# EAGLE board v3c_pcb (EAGLE 6.5.0), part 1 of 3
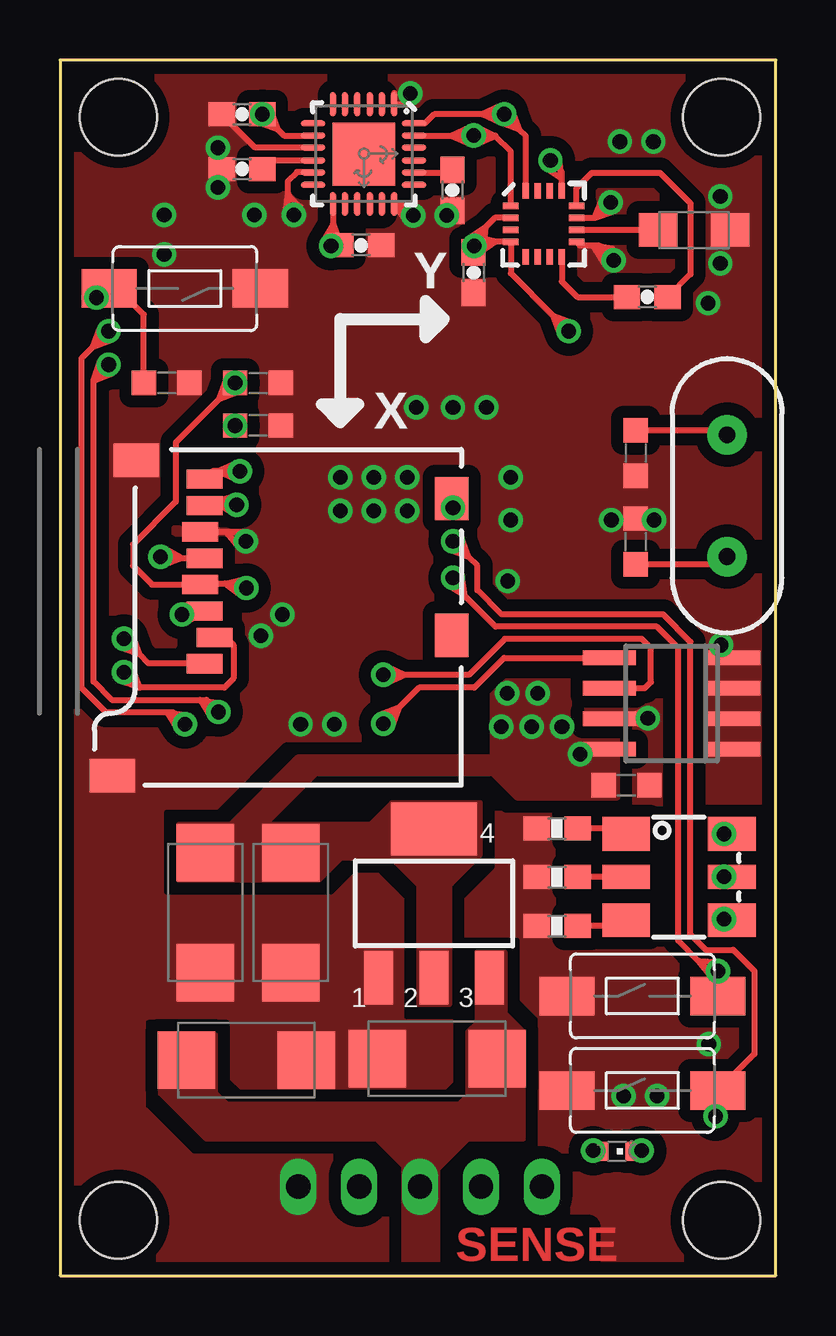
[diagram p2: board, top side]
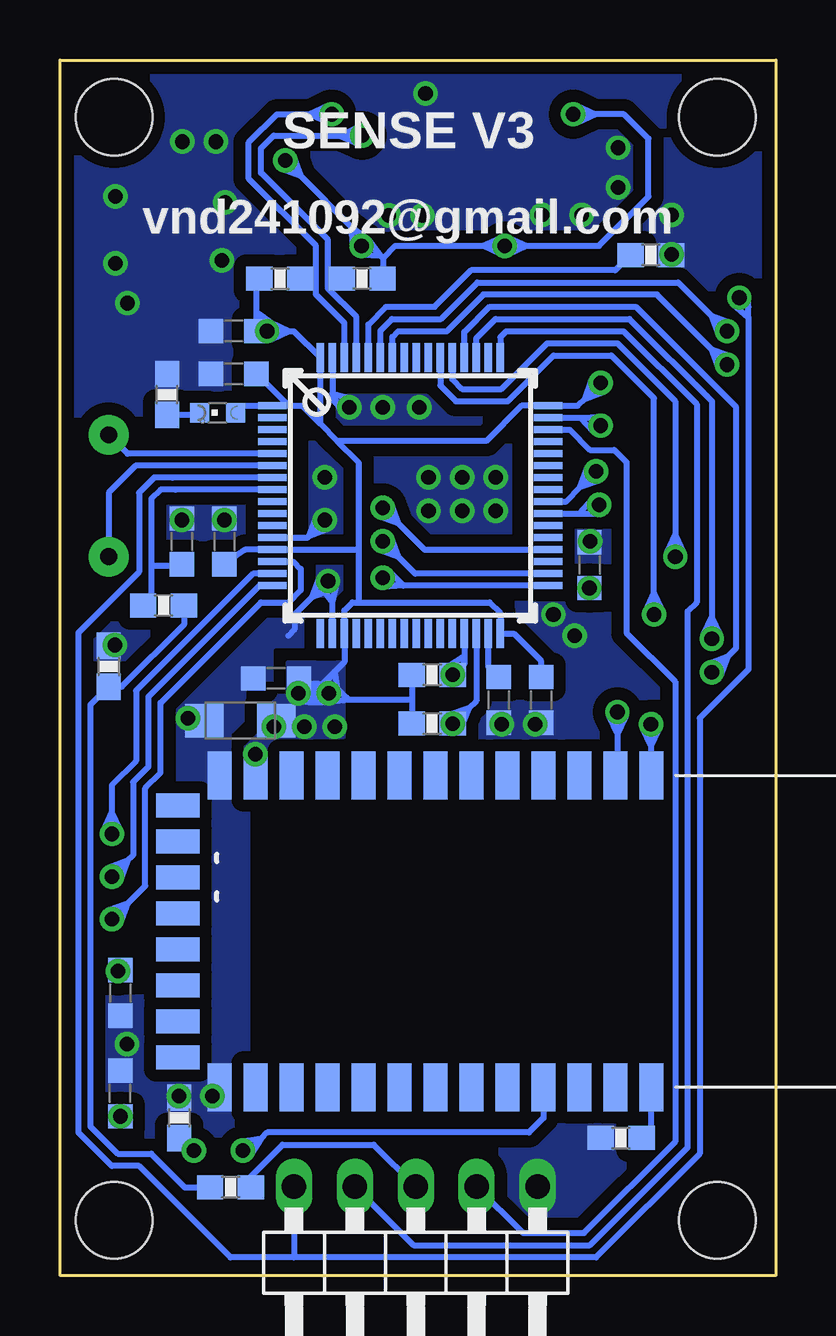
[diagram p3: board, bottom side, seen from below]

Size 29.84 x 50.67 mm. Coordinates in mm from the lower left corner, seen from the top.
Outline: 29.84,50.67 0,50.67 0,0 29.84,0 29.84,50.67
Copper layers (1*16): Top 0.035mm / dielectric 1.5mm / Bottom 0.035mm
Design rules "default *": minimum track width 10mil, minimum drill 24mil, track to track 8mil, track to pad 8mil, pad to pad 0mil, via to via 10mil, smd to smd 8mil, copper to edge 20mil, drill to drill 10mil, minimum pad ring 10mil, minimum via ring 8mil, stop-mask expansion 0mil, vias tented up to drill 100mil, thermal gap 10mil
Net classes: 1 power: width 0.15 mm, drill 0.2 mm, clearance 0.152 mm
Holes 3.2 mm at 2.44,48.29 27.58,48.29 2.44,2.31 27.58,2.31

## Footprints (pad centres in the part's own frame; a part is rotated, then mirrored left to right if it is on the bottom)
C-0603 = smd 1.016 x 1.016: 1 -0.953,0; 2 0.953,0
SMC_C = smd 2.4 x 2.4: + -2.5,0; - 2.5,0
SMC_A = smd 1.6 x 1.4: + -1.5,0; - 1.5,0
SPARKFUN_0603-CAP = smd 1.1 x 1: 1 -0.85,0; 2 0.85,0
SO-08 = smd 0.6 x 2.2: 1 -1.905,-2.6; 2 -0.635,-2.6; 3 0.635,-2.6; 4 1.905,-2.6; 5 1.905,2.6; 6 0.635,2.6; 7 -0.635,2.6; 8 -1.905,2.6
LINEAR_SOT223 = smd 1.219 x 2.235: 1 -2.311,-3.099; 2 0,-3.099; 3 2.311,-3.099 | smd 3.6 x 2.2: 4 0,3.099
TESTING_QFN-24-4MM2 = smd 1.016 x 0.254: 1 -2.066,1.257; 2 -2.066,0.75; 3 -2.066,0.247; 4 -2.066,-0.287; 5 -2.066,-0.792; 6 -2.066,-1.297; 13 2.086,-1.297; 14 2.086,-0.792; 15 2.086,-0.287; 16 2.086,0.247; 17 2.086,0.75; 18 2.086,1.257 | smd 0.254 x 1.016: 7 -1.267,-2.122; 8 -0.762,-2.122; 9 -0.258,-2.122; 10 0.278,-2.122; 11 0.78,-2.122; 12 1.287,-2.122; 19 1.287,2.082; 20 0.78,2.082; 21 0.278,2.082; 22 -0.258,2.082; 23 -0.762,2.082; 24 -1.267,2.082 | smd 2.616 x 2.616: P$1 0.02,-0.01
SPARKFUN_16LPCC = smd 0.65 x 0.28: 1 -1.37,0.75; 2 -1.37,0.25; 3 -1.37,-0.25; 4 -1.37,-0.75; 9 1.37,-0.75; 10 1.37,-0.25; 11 1.37,0.25; 12 1.37,0.75 | smd 0.28 x 0.65: 5 -0.75,-1.37; 6 -0.25,-1.37; 7 0.25,-1.37; 8 0.75,-1.37; 13 0.75,1.37; 14 0.25,1.37; 15 -0.25,1.37; 16 -0.75,1.37
1X05/90 = drill 1.016 long: 1 -5.08,-3.81; 2 -2.54,-3.81; 3 0,-3.81; 4 2.54,-3.81; 5 5.08,-3.81
CHIPLED_0603 = smd 0.8 x 0.8: A 0,-0.75; C 0,0.75
SPARKFUN_0603-RES = smd 1.1 x 1: 1 -0.85,0; 2 0.85,0
TACTILE-SWITCH-1101NE = smd 2.3 x 1.6: P$1 -3.15,0; P$2 3.15,0
MICRO-SD-SOCKET-PP = smd 0.8 x 1.5: 1 -8.94,10.7; 2 -7.84,10.3; 3 -6.74,10.7; 4 -5.64,10.9; 5 -4.54,10.7; 6 -3.44,10.9; 7 -2.34,10.7; 8 -1.24,10.7 | smd 1.8 x 1.4: CD1 -2.05,0.4; CD2 -7.75,0.4 | smd 1.4 x 1.9: GND1 -13.6,14.55; GND3 -0.45,13.55
BLUETOOTH_SMD = smd 2 x 1: 1 0,0; 2 0,-1.5; 3 0,-3; 4 0,-4.5; 5 0,-6; 6 0,-7.5; 7 0,-9; 8 0,-10.5; 9 0,-12; 10 0,-13.5; 11 0,-15; 12 0,-16.5; 13 0,-18; 22 13,-18; 23 13,-16.5; 24 13,-15; 25 13,-13.5; 26 13,-12; 27 13,-10.5; 28 13,-9; 29 13,-7.5; 30 13,-6; 31 13,-4.5; 32 13,-3; 33 13,-1.5; 34 13,0 | smd 1 x 1.8: 14 1.25,-19.75; 15 2.75,-19.75; 16 4.25,-19.75; 17 5.75,-19.75; 18 7.25,-19.75; 19 8.75,-19.75; 20 10.25,-19.75; 21 11.75,-19.75
LQFP64 = smd 0.3 x 1.2: 1 -3.75,-5.75; 2 -3.25,-5.75; 3 -2.75,-5.75; 4 -2.25,-5.75; 5 -1.75,-5.75; 6 -1.25,-5.75; 7 -0.75,-5.75; 8 -0.25,-5.75; 9 0.25,-5.75; 10 0.75,-5.75; 11 1.25,-5.75; 12 1.75,-5.75; 13 2.25,-5.75; 14 2.75,-5.75; 15 3.25,-5.75; 16 3.75,-5.75; 33 3.75,5.75; 34 3.25,5.75; 35 2.75,5.75; 36 2.25,5.75; 37 1.75,5.75; 38 1.25,5.75; 39 0.75,5.75; 40 0.25,5.75; 41 -0.25,5.75; 42 -0.75,5.75; 43 -1.25,5.75; 44 -1.75,5.75; 45 -2.25,5.75; 46 -2.75,5.75; 47 -3.25,5.75; 48 -3.75,5.75 | smd 1.2 x 0.3: 17 5.75,-3.75; 18 5.75,-3.25; 19 5.75,-2.75; 20 5.75,-2.25; 21 5.75,-1.75; 22 5.75,-1.25; 23 5.75,-0.75; 24 5.75,-0.25; 25 5.75,0.25; 26 5.75,0.75; 27 5.75,1.25; 28 5.75,1.75; 29 5.75,2.25; 30 5.75,2.75; 31 5.75,3.25; 32 5.75,3.75; 49 -5.75,3.75; 50 -5.75,3.25; 51 -5.75,2.75; 52 -5.75,2.25; 53 -5.75,1.75; 54 -5.75,1.25; 55 -5.75,0.75; 56 -5.75,0.25; 57 -5.75,-0.25; 58 -5.75,-0.75; 59 -5.75,-1.25; 60 -5.75,-1.75; 61 -5.75,-2.25; 62 -5.75,-2.75; 63 -5.75,-3.25; 64 -5.75,-3.75
SMD = smd 1.99 x 1.4: B+ -2.2,-1.8; B- 2.2,-1.8; R+ -2.2,1.8; R- 2.2,1.8 | smd 1.99 x 1: G+ -2.2,0; G- 2.2,0
HC49US = drill 0.7 pad 1.651: 1 -2.54,0; 2 2.54,0

## Placement (x,y rotation side)
C1  [C-0603]  24,30.61 90 top
C2  [C-0603]  7.77,29.62 270 bottom
C3  6v 10u  [SMC_C]  9.63,15.14 270 top
C4  6v 10u  [SMC_A]  22.33,23.14 180 bottom
C5  16v47u  [SMC_C]  15.72,9.04 180 top
C6  [C-0603]  22.61,37.59 0 bottom
C7  [C-0603]  27.33,7.59 90 bottom
C8  [C-0603]  8.26,37.21 180 top
C9  [C-0603]  22.99,30.61 270 bottom
C10  [C-0603]  22.61,39.37 0 bottom
C11  [C-0603]  23.62,20.45 180 top
C12  [C-0603]  9.78,24 90 bottom
C13  [C-0603]  4.45,37.21 0 top
C14  [C-0603]  20.83,24.89 0 bottom
C15  [C-0603]  24,34.29 270 top
C16  16v47u  [SMC_C]  7.77,8.99 0 top
C17  [C-0603]  8.26,35.43 0 top
C18  [C-0603]  11.56,24 270 bottom
C19  [C-0603]  24.77,30.61 270 bottom
C23  6v 10u  [SMC_C]  6.07,15.14 270 top
C25  [C-0603]  27.33,11.79 270 bottom
C26  100n  [SPARKFUN_0603-CAP]  7.59,46.13 180 top
C27  100n  [SPARKFUN_0603-CAP]  24.49,40.79 0 top
C28  4.7u  [SMC_A]  26.44,43.59 0 top
C29  100n  [SPARKFUN_0603-CAP]  17.25,41.81 270 top
C36  2.2n  [SPARKFUN_0603-CAP]  16.36,45.24 270 top
C38  100n  [SPARKFUN_0603-CAP]  12.55,42.95 0 top
C39  100n  [SPARKFUN_0603-CAP]  7.59,48.41 180 top
IC2  24LC256SN  [SO-08]  25.5,23.85 90 top
IC3  LINEAR_MC33269ST-3.3T3  [LINEAR_SOT223]  15.6,15.52 0 top
IC4  MPU-6050  [TESTING_QFN-24-4MM2]  12.67,46.76 270 top
IC5  HMC5883L  [SPARKFUN_16LPCC]  20.17,43.84 0 top
JP4  [1X05/90]  15.01,-0.1 180 bottom
LD1  [CHIPLED_0603]  23.22,5.18 270 top
LD2  [CHIPLED_0603]  23.27,35.97 90 bottom
R1  10K  [SPARKFUN_0603-RES]  25.37,36.73 90 bottom
R2  10K  [SPARKFUN_0603-RES]  20.73,14.58 180 top
R3  10K  [SPARKFUN_0603-RES]  20.73,16.61 180 top
R5  10K  [SPARKFUN_0603-RES]  6.45,5.74 180 bottom
R6  10K  [SPARKFUN_0603-RES]  20.73,18.64 180 top
R7  10k  [SPARKFUN_0603-RES]  5.21,42.55 0 bottom
R9  10K  [SPARKFUN_0603-RES]  24.87,6.58 90 bottom
R10  [SPARKFUN_0603-RES]  17.25,41.55 0 bottom
R11  [SPARKFUN_0603-RES]  20.68,41.55 180 bottom
R15  4K7  [SPARKFUN_0603-RES]  14.33,25.04 0 bottom
R16  4K7  [SPARKFUN_0603-RES]  14.33,23.01 180 bottom
R23  10K  [SPARKFUN_0603-RES]  25.53,27.94 180 bottom
R24  10K  [SPARKFUN_0603-RES]  22.73,3.68 0 bottom
R25  10K  [SPARKFUN_0603-RES]  27.81,25.4 270 bottom
S1  RESET  [TACTILE-SWITCH-1101NE]  5.21,41.15 180 top
S2  RESET  [TACTILE-SWITCH-1101NE]  24.28,11.66 0 top
S4  RESET  [TACTILE-SWITCH-1101NE]  24.28,7.72 0 top
SDCARD2  microSD Socket  [MICRO-SD-SOCKET-PP]  16.74,34.44 90 top
U1  HC_05  [BLUETOOTH_SMD]  5.18,20.85 270 bottom
U2  STM32F405RGT  [LQFP64]  15.24,32.51 270 bottom
U$12  RGB_LED  [SMD]  25.81,16.61 0 top
Y2  [HC49US]  27.81,32.51 90 top

## Tracks (layer width: path | path; a pad name or v marks a point on that pad's centre or on a via)
3.3V  (via drill 0.61)
  Top 0.254: 5.82,28.82 5.82,28.85 5.84,28.85 | IC5.2 18.13,44.09 17.75,43.71 | 5.84,28.85 SDCARD2.4 3.84,28.8 3.05,29.59 3.05,30.48 4.83,32.26 4.83,34.73 6.66,36.56 | 9.75,18.53 C3.+ | 20.56,40.02 18.8,41.78 IC5.4 18.17,43.09 | 20.56,40.02 | 20.56,40.02 v21.21,39.37 | 5.84,28.85 6.88,28.85 | 6.88,28.85 7.58,28.85 C2.2 | 20.56,40.02 | 20.56,40.02 21.34,39.73 | v21.21,39.37 21.34,39.73 | 20.56,40.02 | 20.56,40.02 20.85,39.24 | v21.21,39.37 20.85,39.24 | 20.56,40.02 21.34,39.73 | 20.56,40.02 21.34,39.73 | 21.34,39.73 | 6.88,28.85 7.69,29.04 | 7.69,29.04 | 6.88,28.85 7.54,28.36 | C2.2 7.54,28.36 | v17.27,42.93 17.27,43.23 17.75,43.71 | v17.27,42.93 17.27,42.68 C29.1 | 18.17,43.09 17.44,43.09 v17.27,42.93 | C38.1 11.33,42.95 v11.3,42.93 | IC4.13 11.38,43.84 | 11.38,43.84 11.38,43 v11.3,42.93 | IC5.13 20.92,45.7 | 20.92,45.7 20.92,46.01 v20.45,46.48 | C8.2 6.66,36.56 | C39.1 9.09,47.77 | 9.09,47.77 | 9.09,47.77 9.33,47.52 IC4.8 | 20.56,40.02 | 20.56,40.02 21.34,39.73 | 20.56,40.02 20.85,39.24 | 20.85,39.24 | v21.21,39.37 20.85,39.24 | 21.05,39.72 | v21.21,39.37 21.05,39.72 | v21.21,39.37 21.05,39.72 | 21.34,39.73 | v21.21,39.37 21.34,39.73 | 20.56,40.02 20.85,39.24 | v21.21,39.37 20.85,39.24 | 7.69,29.04 | C2.2 7.69,29.04 | 6.88,28.85 7.54,28.36 | C2.2 7.54,28.36 | 17.75,43.71 17.65,42.88 | 17.65,42.88 | 17.75,43.71 17.06,43.24 | v17.27,42.93 17.06,43.24 | 18.17,43.09 17.49,42.61 | v17.27,42.93 17.49,42.61 | 18.17,43.09 17.37,43.3 | v17.27,42.93 17.37,43.3 | 11.38,43.84 11.66,43.06 | 11.66,43.06 | 11.38,43.84 10.97,43.11 | v11.3,42.93 10.97,43.11 | 20.92,45.7 20.23,46.17 | v20.45,46.48 20.23,46.17 | 20.92,45.7 20.83,46.52 | 20.83,46.52 | 6.66,36.56 6.95,37.34 | C8.2 6.95,37.34 | 7.43,36.85 | 7.43,36.85
  Top 0.254: 9.09,47.77 8.31,48.05 | C39.1 8.31,48.05 | 9.09,47.77 8.8,48.55 | 8.8,48.55 | 20.56,40.02 20.85,39.24 | 20.85,39.24 | v21.21,39.37 20.85,39.24 | 20.56,40.02 21.34,39.73 | v21.21,39.37 21.05,39.72 | 20.56,40.02 20.85,39.24 | v21.21,39.37 20.85,39.24 | 20.56,40.02 21.34,39.73 | v21.21,39.37 21.34,39.73 | 6.88,28.85 7.54,28.36 | C2.2 7.54,28.36 | 6.88,28.85 7.69,29.04 | C2.2 7.69,29.04 | 17.75,43.71 17.06,43.24 | v17.27,42.93 17.06,43.24 | 17.75,43.71 17.65,42.88 | v17.27,42.93 17.65,42.88 | 18.17,43.09 17.37,43.3 | v17.27,42.93 17.37,43.3 | 18.17,43.09 17.49,42.61 | v17.27,42.93 17.49,42.61 | 11.38,43.84 10.97,43.11 | v11.3,42.93 10.97,43.11 | 11.38,43.84 11.66,43.06 | v11.3,42.93 11.66,43.06 | 20.92,45.7 20.83,46.52 | v20.45,46.48 20.83,46.52 | 20.92,45.7 20.23,46.17 | v20.45,46.48 20.23,46.17 | 6.66,36.56 | 6.66,36.56 7.43,36.85 | C8.2 7.43,36.85 | 6.66,36.56 | 6.66,36.56 6.95,37.34 | C8.2 6.95,37.34 | 6.66,36.56 7.43,36.85 | 6.66,36.56 6.95,37.34 | 6.66,36.56 7.43,36.85 | C8.2 7.43,36.85 | 6.66,36.56 6.95,37.34 | C8.2 6.95,37.34 | 9.09,47.77 8.8,48.55 | C39.1 8.8,48.55 | 9.09,47.77 | 9.09,47.77 8.31,48.05 | C39.1 8.31,48.05 | 9.09,47.77 | 9.09,47.77 8.31,48.05 | 9.09,47.77 8.8,48.55 | C39.1 8.8,48.55 | 9.09,47.77 8.31,48.05 | C39.1 8.31,48.05
  Bottom 0.254: R10.2 16.36,41.34 | 18.4,25.16 17.99,25.57 U2.19 17.99,27.73 17.65,28.07 17.4,28.07 | 18.4,25.16 18.92,24.64 19.07,24.64 | 19.07,24.64 19.49,24.64 | 19.49,24.64 20.19,24.64 | R15.1 15.18,24 | 15.18,24 R16.2 | 15.18,24 17.77,24 | 17.77,24 18.03,24 | 8,28.56 8,28.43 C2.2 7.48,28.42 | 20.32,36.26 U2.1 22.22,36.26 LD2.A | 18.29,34.8 17.4,33.91 17.4,30.35 | 18.29,34.8 18.99,35.5 | 18.99,35.5 U2.64 20.1,39.37 20.3,39.37 | 18.99,35.5 19.75,36.26 20.32,36.26 | 17.4,28.07 11.94,28.07 11.49,27.62 U2.32 10.92,26.76 9.78,25.62 C12.2 | v21.21,39.37 20.3,39.37 | v21.21,39.37 C10.2 21.65,40.17 | 21.65,40.17 21.65,41.17 R11.2 | C6.2 20.32,36.26 | 17.4,30.35 17.4,28.07 | 17.4,30.35 17.49,30.26 U2.13 22.12,30.26 C9.2 | 18.29,34.8 12.06,34.8 10.6,36.26 U2.48 8.25,36.26 7.95,36.56 | U1.12 21.69,20.86 v21.69,21.74 | 21.05,39.72 | 21.05,39.72 | 20.3,39.37 | 20.3,39.37 21.05,39.02 | v21.21,39.37 21.05,39.02 | 21.05,39.72 | 21.05,39.72 | 20.3,39.37 21.05,39.02 | v21.21,39.37 21.05,39.02 | 21.05,39.72 | 21.05,39.72 | 20.3,39.37 21.05,39.02 | v21.21,39.37 21.05,39.02 | 21.65,40.17 21.59,39.34 | v21.21,39.37 21.59,39.34 | 21.65,40.17 20.98,39.68 | v21.21,39.37 20.98,39.68 | 19.07,24.64 19.48,24.65 | 19.48,24.65 19.9,24.66 | 19.9,24.66 | 19.07,24.64 19.54,24.12 | 19.54,24.12 19.63,24.02 | v19.91,24.28 19.63,24.02 | 19.82,23.91 | v19.91,24.28 19.82,23.91 | 19.08,24.65 19.91,24.66 | 19.91,24.66 | 19.08,24.65 19.54,24.12 | 19.54,24.12 19.63,24.03 | 19.63,24.03 | v19.91,24.28 19.63,24.03 | 19.48,24.65 19.01,24.12 | 19.01,24.12 | 19.01,24.12 18.93,24.03 | v18.64,24.28 18.93,24.03 | 19.48,24.65 18.65,24.66 | 18.65,24.66 | 18.74,23.91 | v18.64,24.28 18.74,23.91 | 19.54,24.12 19.02,24.48 | 19.02,24.48 18.86,24.6
  Bottom 0.254: 18.86,24.6 | 18.4,25.16 18.93,24.53 | 18.93,24.53 | 18.4,25.16 18.27,24.34 | v18.64,24.28 18.27,24.34 | 19.49,24.64 19.01,24.12 | 19.01,24.12 18.93,24.02 | v18.64,24.28 18.93,24.02 | 19.49,24.64 19.08,24.65 | 19.08,24.65 18.66,24.66 | 18.66,24.66 | 18.39,24.56 | v18.64,24.28 18.39,24.56 | 17.77,24 18.6,23.9 | v18.64,24.28 18.6,23.9 | R10.2 16.4,42.05 | v11.3,42.93 10.39,42.93 | 10.39,42.93 7.37,42.93 5.31,44.98 5.31,47.4 6.33,48.41 7.53,48.41 | v20.45,46.48 19.8,45.84 | 19.8,45.84 | 19.8,45.84 17.7,43.73 | 17.7,43.73 16.89,42.93 | 16.38,42.42 16.38,41.27 16.4,41.29 R10.2 | 16.38,42.42 16.46,42.5 | 16.46,42.5 16.89,42.93 | 16.89,42.93 v17.27,42.93 | 16.38,42.42 15.88,42.93 12.22,42.93 | 12.22,42.93 v11.3,42.93 | 19.08,24.65 19.48,24.66 | 19.08,24.65 19.54,24.12 | 19.05,23.99 18.74,23.91 | 19.54,24.13 19.63,24.03 | 19.05,23.99 18.74,23.91 | 18.74,23.91 | 19.54,24.12 | 19.05,23.99 18.74,23.91 | 18.74,23.91 | 18.74,23.91 | 18.74,23.91 | 19.54,24.12 | 18.88,23.98 | v18.64,24.28 18.88,23.98 | 19.54,24.13 | 19.05,23.99 18.74,23.91 | 18.74,23.91 | 18.74,23.91 | 19.54,24.13 | 19.54,24.13 19.02,24.48 | 19.54,24.46 19.02,24.08 | 19.02,24.08 18.86,23.97 | 18.86,23.97 | 19.54,24.12 19.02,24.48 | 19.54,24.12 19.02,24.48 | 19.02,24.48 | 17.7,43.73 | 17.7,43.73 17.65,42.9 | v17.27,42.93 17.65,42.9 | 17.7,43.73 | 17.7,43.73 17.04,43.23 | v17.27,42.93 17.04,43.23 | 16.46,42.5 | 16.46,42.5 16.97,43.16 | v17.27,42.93 16.97,43.16 | 16.46,42.5 | 17.7,43.73 17.65,42.9 | 17.7,43.73 17.04,43.23 | v17.27,42.93 17.04,43.23 | 16.46,42.5 16.97,43.16 | v17.27,42.93 16.97,43.16 | 16.46,42.5 17.29,42.55 | 12.22,42.93 11.46,42.58 | 19.8,45.84 | 20.09,46.62 | 19.8,45.84 | 19.8,45.84 20.58,46.12 | 20.58,46.12 | 19.55,24.13 19.62,24.03
  Bottom 0.254: 19.82,23.91 | 19.02,24.48 | 19.02,24.48 19.51,24.59 | 19.02,24.48 19.54,24.09 | 19.05,24.59 19.49,24.63 | 19.05,24.59 19.54,24.11 | 19.55,24.13 19.62,24.03 | 19.65,24.56 | v19.91,24.28 19.65,24.56 | 19.54,24.08 19.7,23.97 | 19.7,23.97 | 19.54,24.12 19.64,24.02 | 19.64,24.02 | 19.65,24.01 | 19.82,24.65 | 19.55,24.13 19.62,24.03 | 19.54,24.09 19.68,23.98 | 19.82,23.91 | 19.82,23.91 | 18.68,23.9 | 19.02,24.08 18.86,23.97 | 18.86,23.97 | 19.02,24.11 18.91,24 | 18.91,24 | 19.51,24.58 19.07,24.62 | 19.07,24.62 18.68,24.66 | 18.68,24.66 | 19.54,24.48 19.02,24.09 | 19.02,24.09 18.88,23.98 | 19.05,24.59 18.72,24.66 | v18.64,24.28 18.68,23.9 | 19.51,23.99 19.02,24.46 | 18.9,24.56 | 19.48,24.66 19.01,24.13 | 19.01,24.13 | 19.01,24.13 18.93,24.03 | 19.55,24.13 | 19.05,23.99 18.74,23.91 | 18.74,23.91 | 19.55,24.13 | 19.55,24.13 19.02,24.48 | 19.02,24.48 18.86,24.6 | 18.86,24.6 | 18.86,23.97 | 18.73,24.65 | 18.86,23.97 | 19.02,24.09 18.88,23.98 | 19.48,24.65 19.01,24.12 | 19.05,23.99 18.74,23.91 | 19.05,24.59 18.72,24.66 | 18.72,24.66 | 19.54,24.13 19.05,23.99 | 19.05,23.99 18.74,23.91 | 18.93,24.03 | 19.48,24.65 19.01,24.12 | 19.01,24.12 | 19.05,23.99 18.74,23.91 | 19.8,45.84 | 7.95,36.56 | 7.95,36.56 C8.2 | 7.53,48.41 C39.1 | 20.3,39.37 21.05,39.72 | 21.05,39.72 | v21.21,39.37 21.05,39.72 | 20.3,39.37 21.05,39.02 | 21.05,39.02 | v21.21,39.37 21.05,39.02 | 21.65,40.17 21.59,39.34 | 21.59,39.34 | 21.65,40.17 20.98,39.68 | v21.21,39.37 20.98,39.68 | 19.7,24.6 | 19.01,24.12 19.54,24.48 | 19.01,24.12 19.51,23.99 | 19.82,23.91 | v19.91,24.28 19.82,23.91 | 19.91,24.66 | v19.91,24.28 19.91,24.66 | 19.08,24.66 19.54,24.13 | 19.54,24.13 19.63,24.03 | 19.63,24.03 | v19.91,24.28 19.63,24.03 | 19.54,24.48 19.7,24.59 | 19.7,24.59 19.7,24.6 | v19.91,24.28 19.7,24.6
  Bottom 0.254: 19.05,24.59 19.54,24.11 | 19.54,24.11 19.65,24.01 | 19.05,23.99 19.54,24.46 | 19.05,23.99 | 19.84,24.66 | 19.9,24.66 | v19.91,24.28 19.9,24.66 | 19.07,24.64 19.54,24.12 | 19.54,24.12 19.63,24.02 | v19.91,24.28 19.63,24.02 | 19.91,24.66 | v19.91,24.28 19.91,24.66 | 19.08,24.65 19.54,24.12 | 19.65,24.56 | 19.65,24.56 | 19.82,23.91 | 19.83,23.91 | 19.84,24.66 | 19.65,24.56 | v19.91,24.28 19.65,24.56 | 19.68,23.98 | 19.68,23.98 | 19.02,24.09 19.54,24.48 | 19.83,23.91 | 19.83,23.91 | 19.82,23.91 | v19.91,24.28 19.82,23.91 | 19.65,24.56 | 19.83,23.91 | 19.83,23.91 | 19.54,24.48 19.68,24.59 | 19.83,23.91 | 19.83,23.91 | v19.91,24.28 19.83,23.91 | 19.87,24.66 | 19.65,24 | 19.65,24 | v19.91,24.28 19.65,24 | 19.9,23.9 | 19.88,23.9 | 19.88,23.9 | 19.88,23.9 | 19.84,24.66 | v19.91,24.28 19.84,24.66 | 19.68,23.98 | 19.02,24.09 19.54,24.48 | 19.54,24.48 19.69,24.59 | 19.83,23.91 | v19.91,24.28 19.83,23.91 | 19.82,24.65 | 19.82,24.65 | v19.91,24.28 19.82,24.65 | 19.69,23.97 | 19.69,23.97 | v19.91,24.28 19.69,23.97 | 19.08,24.66 19.55,24.13 | 19.55,24.13 19.62,24.03 | 19.62,24.03 19.63,24.03 | 19.63,24.03 | v19.91,24.28 19.63,24.03 | 19.05,23.99 19.54,24.46 | 19.65,24.56 | v19.91,24.28 19.65,24.56 | 19.54,24.09 19.68,23.98 | v19.91,24.28 19.68,23.98 | 19.01,24.12 | 19.82,23.91 | 19.84,24.66 | v19.91,24.28 19.84,24.66 | 19.54,24.09 19.68,23.98 | 19.68,23.98 | v19.91,24.28 19.68,23.98 | 19.02,24.48 19.68,23.98 | 19.82,23.91 | 19.82,23.91 | 19.54,24.48 19.69,24.59 | v19.91,24.28 19.69,24.59 | 19.88,24.66 | v19.91,24.28 19.88,24.66 | 19.54,24.11 19.65,24.01 | 19.65,24.01 | 19.65,24.01 | v19.91,24.28 19.65,24.01 | 19.82,23.91 | 19.82,23.91 | v19.91,24.28 19.82,23.91 | 19.65,24.56 | 19.69,23.97 | 19.65,24.56 | 19.87,23.9 | 19.68,23.98 | 19.89,23.9 | 19.02,24.09 19.54,24.48
  Bottom 0.254: 19.02,24.09 | 19.83,23.91 | 19.54,24.11 19.65,24.01 | 19.65,24.01 | v19.91,24.28 19.65,24.01 | 19.07,23.94 19.54,24.45 | 19.54,24.45 19.64,24.54 | v19.91,24.28 19.64,24.54 | 19.82,24.65 | v19.91,24.28 19.82,24.65 | 19.02,24.45 19.69,23.97 | 19.69,23.97 | 19.69,23.97 | 19.69,23.97 | v19.91,24.28 19.69,23.97 | 19.01,24.12 19.7,24.59 | 19.7,24.59 | v19.91,24.28 19.7,24.59 | 19.01,24.12 19.51,23.99 | 19.51,23.99 19.82,23.91 | 19.82,23.91 | 19.82,23.91 | v19.91,24.28 19.82,23.91 | 19.91,24.66 | v19.91,24.28 19.91,24.66 | 19.07,24.64 19.63,24.03 | v19.91,24.28 19.63,24.03 | v19.91,24.28 19.65,24.56 | 19.68,23.98 | 19.68,23.98 | 19.68,23.98 | v19.91,24.28 19.68,23.98 | 19.02,24.08 19.54,24.48 | v19.91,24.28 19.87,24.66 | 19.08,23.91 19.54,24.44 | 19.54,24.44 19.63,24.54 | v19.91,24.28 19.63,24.54 | 19.91,23.9 | 19.82,24.65 | v19.91,24.28 19.82,24.65 | 19.02,24.11 19.69,24.59 | 19.02,24.11 | 19.82,23.91 | 19.89,24.66 | v19.91,24.28 19.89,24.66 | 19.54,24.12 19.64,24.02 | 19.64,24.02 | 19.64,24.02 | v19.91,24.28 19.64,24.02 | 19.05,23.98 19.65,24.56 | v19.91,24.28 19.65,24.56 | 19.88,23.9 | v19.91,24.28 19.88,23.9 | 19.68,23.98 | 19.68,23.98 | v19.91,24.28 19.68,23.98 | 19.69,24.59 | v19.91,24.28 19.69,24.59 | 19.83,23.91 | v19.91,24.28 19.83,23.91 | 19.88,24.66 | v19.91,24.28 19.88,24.66 | 19.54,24.11 19.65,24.01 | v19.91,24.28 19.65,24.01 | 19.64,24.55 | 19.64,24.55 | v19.91,24.28 19.64,24.55 | 19.89,23.9 | v19.91,24.28 19.89,23.9 | 19.82,24.65 | v19.91,24.28 19.82,24.65 | 19.69,23.97 | v19.91,24.28 19.69,23.97 | 19.01,24.13 19.54,24.48 | 19.54,24.48 19.7,24.6 | 19.7,24.6 | 19.7,24.6 | 19.7,24.6 | v19.91,24.28 19.7,24.6 | 19.01,24.13 19.51,24 | 19.82,23.91 | v19.91,24.28 19.82,23.91 | 19.91,24.66 | v19.91,24.28 19.91,24.66 | 19.55,24.13 19.62,24.03
  Bottom 0.254: v19.91,24.28 19.62,24.03 | 19.05,23.99 19.54,24.46 | 19.54,24.46 19.65,24.56 | 19.65,24.56 | 19.65,24.56 | 19.87,23.9 | v19.91,24.28 19.87,23.9 | 19.84,24.66 | 19.84,24.66 | v19.91,24.28 19.84,24.66 | 19.68,23.98 | v19.91,24.28 19.68,23.98 | 19.68,24.59 | 19.83,23.91 | v19.91,24.28 19.83,23.91 | 19.88,24.66 | 19.88,24.66 | v19.91,24.28 19.88,24.66 | 19.54,24.44 19.63,24.54 | 19.63,24.54 | v19.91,24.28 19.63,24.54 | 19.9,23.9 | v19.91,24.28 19.9,23.9 | 19.82,24.65 | 19.01,24.45 19.7,23.97 | v19.91,24.28 19.7,23.97 | 19.02,24.11 19.69,24.59 | 19.69,24.59 | v19.91,24.28 19.69,24.59 | 19.02,24.11 | 19.9,24.66 | 19.9,24.66 | v19.91,24.28 19.9,24.66 | 19.07,24.63 19.64,24.02 | v19.91,24.28 19.64,24.02 | 19.05,23.98 19.54,24.45 | 19.54,24.45 19.65,24.56 | 19.65,24.56 | v19.91,24.28 19.65,24.56 | 19.88,23.9 | v19.91,24.28 19.88,23.9 | 19.83,24.66 | 19.83,24.66 | v19.91,24.28 19.83,24.66 | 19.68,23.98 | v19.91,24.28 19.68,23.98 | 19.01,24.13 19.54,24.48 | 19.54,24.48 19.7,24.6 | 19.7,24.6 | v19.91,24.28 19.7,24.6 | 19.51,23.99 19.82,23.91 | 19.68,24.59 | v19.91,24.28 19.68,24.59 | 19.88,24.66 | v19.91,24.28 19.88,24.66 | 19.54,24.11 19.65,24 | v19.91,24.28 19.65,24 | 19.89,23.9 | 19.01,24.12 19.54,24.48 | 19.01,24.12 19.51,23.99 | 19.08,24.66 19.54,24.13 | 19.63,24.03 | v19.91,24.28 19.63,24.03 | 19.87,23.9 | 19.87,23.9 | 19.02,24.09 19.54,24.48 | 19.54,24.48 19.68,24.59 | 19.69,24.59 | v19.91,24.28 19.69,24.59 | 19.83,23.91 | v19.91,24.28 19.83,23.91 | 19.88,24.66 | v19.91,24.28 19.88,24.66 | 19.65,24.01 | v19.91,24.28 19.65,24.01 | 19.06,23.95 19.54,24.45 | 19.54,24.45 19.64,24.55 | 19.64,24.55 | v19.91,24.28 19.64,24.55 | 19.89,23.9 | v19.91,24.28 19.89,23.9 | 19.82,24.65 | 19.82,24.65 | v19.91,24.28 19.82,24.65 | 19.02,24.46 19.69,23.97
  Bottom 0.254: v19.91,24.28 19.69,23.97 | 19.01,24.13 19.82,23.91 | 19.91,24.66 | v19.91,24.28 19.91,24.66 | 19.08,24.66 19.55,24.13 | 19.55,24.13 19.63,24.03 | v19.91,24.28 19.63,24.03 | 19.05,23.99 19.54,24.46 | 19.54,24.46 19.65,24.56 | 19.65,24.56 | v19.91,24.28 19.65,24.56 | 19.87,23.9 | v19.91,24.28 19.87,23.9 | 19.02,24.48 19.68,23.98 | 19.84,24.66 | v19.91,24.28 19.84,24.66 | 19.54,24.09 19.68,23.98 | v19.91,24.28 19.68,23.98 | 19.07,23.92 19.54,24.44 | 19.54,24.44 19.63,24.54 | 19.63,24.54 | v19.91,24.28 19.63,24.54 | 19.9,23.9 | v19.91,24.28 19.9,23.9 | 19.01,24.45 19.82,24.65 | 19.82,24.65 | v19.91,24.28 19.82,24.65 | 19.01,24.45 19.54,24.08 | 19.54,24.08 19.7,23.97 | v19.91,24.28 19.7,23.97 | 19.69,24.59 | 19.69,24.59 | v19.91,24.28 19.69,24.59 | 19.82,23.91 | v19.91,24.28 19.82,23.91 | 19.9,24.66 | v19.91,24.28 19.9,24.66 | 19.07,24.63 19.54,24.12 | 19.54,24.12 19.64,24.02 | 19.64,24.02 | v19.91,24.28 19.64,24.02 | 19.05,23.98 19.54,24.45 | 19.54,24.45 19.65,24.56 | 19.88,23.9 | v19.91,24.28 19.88,23.9 | 19.83,24.66 | v19.91,24.28 19.83,24.66 | 19.68,23.98 | v19.91,24.28 19.68,23.98 | 19.05,23.99 19.54,24.46 | 19.65,24.56 | v19.91,24.28 19.65,24.56 | 19.87,23.9 | v19.91,24.28 19.87,23.9 | 19.02,24.48 19.54,24.09 | v19.91,24.28 19.83,23.91 | 19.06,23.95 19.54,24.45 | 19.54,24.45 19.64,24.55 | v19.91,24.28 19.64,24.55 | 19.89,23.9 | v19.91,24.28 19.89,23.9 | 19.82,24.65 | v19.91,24.28 19.82,24.65 | 19.02,24.46 19.54,24.08 | 19.54,24.08 19.69,23.97 | 19.69,23.97 | v19.91,24.28 19.69,23.97 | 19.01,24.13 19.54,24.48 | 19.54,24.48 19.7,24.6 | 19.7,24.6 | v19.91,24.28 19.7,24.6 | 19.01,24.13 19.82,23.91 | 19.91,24.66 | v19.91,24.28 19.91,24.66 | 19.55,24.13 19.62,24.03 | 19.05,23.99 19.54,24.46 | 19.54,24.46 19.65,24.56
  Bottom 0.254: 19.65,24.56 | 19.65,24.56 | 19.84,24.66 | 19.02,24.48 19.54,24.09 | 19.01,24.12 19.54,24.48 | 19.54,24.48 19.7,24.6 | 19.7,24.6 | v19.91,24.28 19.7,24.6 | 19.82,23.91 | 19.82,23.91 | v19.91,24.28 19.82,23.91 | 19.08,24.66 19.54,24.13 | 19.02,24.48 19.68,23.98 | v19.91,24.28 19.68,23.98 | 19.65,24.56 | 19.65,24.56 | v19.91,24.28 19.65,24.56 | 19.87,23.9 | v19.91,24.28 19.87,23.9 | 19.84,24.66 | v19.91,24.28 19.84,24.66 | 19.01,24.12 19.54,24.48 | 19.54,24.48 19.7,24.59 | 19.7,24.6 | v19.91,24.28 19.7,24.6 | 19.82,23.91 | v19.91,24.28 19.82,23.91 | 19.08,24.65 19.54,24.12 | 19.54,24.12 19.63,24.03 | 19.63,24.03 | v19.91,24.28 19.63,24.03 | 19.02,24.09 18.88,23.98 | 18.88,23.98 | v18.64,24.28 18.88,23.98 | 18.72,24.66 | 18.72,24.66 | 19.01,24.13 18.93,24.03 | v18.64,24.28 18.93,24.03 | 19.54,24.12 18.74,23.91 | 18.74,23.91 | 19.54,24.13 19.02,24.48 | 19.02,24.48 18.86,24.6 | 19.02,24.09 18.88,23.98 | 19.02,24.48 18.86,24.6 | 19.54,24.13 19.02,24.48 | 19.02,24.48 18.86,24.6 | 18.86,24.6 | 19.54,24.12 | 18.74,23.91 | 19.54,24.12 | 19.54,24.12 19.02,24.48 | 19.02,24.48 18.86,24.6 | v18.64,24.28 18.86,24.6 | 18.68,24.66 | 19.54,24.08 19.05,23.98 | 19.05,23.98 18.72,23.91 | 19.54,24.08 19.02,24.48 | 19.02,24.48 18.87,24.59 | 19.51,24.59 19.02,24.11 | 19.02,24.11 18.91,24.01 | 18.91,24.01 | v18.64,24.28 18.91,24.01 | 18.68,24.66 | v18.64,24.28 18.68,24.66 | 19.06,23.95 18.68,23.9 | 18.87,23.98 | 18.68,23.9 | v18.64,24.28 18.68,23.9 | 19.02,24.45 18.91,24.56 | 19.01,24.12 18.92,24.02 | 18.92,24.02 | 19.54,24.11 18.73,23.91 | 18.73,23.91 | 19.51,23.99 18.68,23.9 | 19.54,24.09 18.87,24.59 | 18.87,24.59 | 18.87,24.59 | 19.02,24.09 18.88,23.98 | 18.88,23.98 | 19.06,23.95 18.68,23.9 | 18.68,23.9 | 19.01,24.13 18.93,24.03 | 18.93,24.03
  Bottom 0.254: 18.93,24.03 | 18.74,23.91 | 19.54,24.46 19.02,24.08 | 18.86,23.97 | v18.64,24.28 18.86,23.97 | 19.54,24.46 19.05,24.58 | 19.05,24.58 18.73,24.65 | 18.73,24.65 | 18.73,24.65 | 18.73,23.91 | 18.73,23.91 | 18.86,23.97 | 19.02,24.11 18.91,24.01 | 18.91,24.01 | 19.07,24.63 18.68,24.66 | 18.68,24.66 | 18.73,23.91 | v18.64,24.28 18.73,23.91 | 19.54,24.09 19.02,24.48 | 19.02,24.48 18.87,24.59 | 19.54,24.48 19.02,24.09 | 19.02,24.09 18.87,23.98 | 18.87,23.98 | v18.64,24.28 18.87,23.98 | 18.73,24.66 | 18.73,24.66 | v18.64,24.28 18.73,24.66 | 19.51,23.98 19.07,23.94 | 19.07,23.94 18.68,23.9 | v18.64,24.28 18.68,23.9 | 19.51,23.98 19.02,24.45 | 19.02,24.45 18.91,24.56 | 18.91,24.56 | 18.91,24.56 | v18.64,24.28 18.91,24.56 | 19.49,24.63 19.01,24.12 | 19.01,24.12 18.92,24.02 | v18.64,24.28 18.92,24.02 | 18.66,24.66 | 18.66,24.66 | v18.64,24.28 18.66,24.66 | 19.54,24.11 18.73,23.91 | v18.64,24.28 18.73,23.91 | 18.86,24.59 | v18.64,24.28 18.86,24.59 | 19.54,24.45 19.02,24.08 | 19.02,24.08 18.86,23.97 | v18.64,24.28 18.86,23.97 | 19.54,24.45 18.74,24.65 | 18.74,24.65 | 18.74,24.65 | v18.64,24.28 18.74,24.65 | 19.48,23.92 19.08,23.91 | 19.08,23.91 18.65,23.9 | v18.64,24.28 18.65,23.9 | 19.48,23.92 19.01,24.44 | 19.01,24.44 18.93,24.54 | 18.93,24.54 | 19.51,24.58 19.02,24.11 | 19.02,24.11 18.91,24 | v18.64,24.28 18.91,24 | 19.51,24.58 19.07,24.62 | 19.07,24.62 18.68,24.66 | 18.68,24.66 | 19.54,24.08 19.05,23.98 | 19.05,23.98 18.72,23.91 | v18.64,24.28 18.72,23.91 | 19.54,24.08 19.02,24.48 | 19.02,24.48 18.88,24.59 | 18.87,24.59 | v18.64,24.28 18.87,24.59 | 19.54,24.48 19.02,24.09 | 19.02,24.09 18.88,23.98 | v18.64,24.28 18.88,23.98 | 19.54,24.48 18.72,24.66 | 18.72,24.66 | 18.72,24.66 | v18.64,24.28 18.72,24.66 | 19.51,23.99 19.06,23.95
  Bottom 0.254: 19.06,23.95 18.68,23.9 | v18.64,24.28 18.68,23.9 | 19.51,23.99 19.02,24.46 | 19.02,24.46 18.9,24.56 | 18.9,24.56 | v18.64,24.28 18.9,24.56 | 19.48,24.66 19.01,24.13 | 19.01,24.13 18.93,24.03 | v18.64,24.28 18.93,24.03 | 19.48,24.66 19.08,24.66 | 19.08,24.66 18.64,24.66 | v18.64,24.28 18.64,24.66 | 19.55,24.13 19.05,24 | 19.05,24 18.74,23.91 | v18.64,24.28 18.74,23.91 | 19.55,24.13 18.86,24.6 | 18.86,24.6 | v18.64,24.28 18.86,24.6 | 19.54,24.46 18.86,23.97 | 18.86,23.97 | v18.64,24.28 18.86,23.97 | 19.54,24.46 19.05,24.58 | 19.05,24.58 18.73,24.65 | 18.73,24.65 | 18.73,24.65 | 18.73,24.65 | 18.73,24.65 | v18.64,24.28 18.73,24.65 | 19.49,23.95 18.66,23.9 | v18.64,24.28 18.66,23.9 | 19.49,23.95 19.01,24.45 | 19.01,24.45 18.92,24.55 | 18.92,24.55 | v18.64,24.28 18.92,24.55 | 19.51,24.59 18.91,24.01 | v18.64,24.28 18.91,24.01 | 19.51,24.59 19.07,24.63 | 19.07,24.63 18.68,24.66 | 18.68,24.66 | v18.64,24.28 18.68,24.66 | 19.54,24.09 19.05,23.98 | 19.05,23.98 18.73,23.91 | v18.64,24.28 18.73,23.91 | 19.54,24.09 19.02,24.48 | 19.02,24.48 18.87,24.59 | 18.87,24.59 | 18.87,24.59 | v18.64,24.28 18.87,24.59 | 19.54,24.48 19.02,24.09 | 19.02,24.09 18.87,23.98 | 18.87,23.98 | v18.64,24.28 18.87,23.98 | 19.54,24.48 18.73,24.65 | 18.73,24.65 | v18.64,24.28 18.73,24.65 | 18.68,23.9 | 19.51,23.98 19.02,24.45 | 19.02,24.45 18.91,24.56 | v18.64,24.28 18.91,24.56 | 19.49,24.62 18.92,24.02 | v18.64,24.28 18.92,24.02 | 19.49,24.62 19.07,24.64 | 19.07,24.64 18.66,24.66 | 18.66,24.66 | v18.64,24.28 18.66,24.66 | 19.54,24.11 18.73,23.91 | 18.73,23.91 | 19.54,24.11 19.02,24.48 | 19.02,24.48 18.86,24.59 | 19.54,24.44 | 19.54,24.44 19.02,24.08 | 19.02,24.08 18.86,23.97 | 18.86,23.97 | v18.64,24.28 18.86,23.97 | 19.54,24.44 | 19.54,24.44 18.74,24.65
  Bottom 0.254: 18.74,24.65 | v18.64,24.28 18.74,24.65 | 18.65,23.9 | v18.64,24.28 18.65,23.9 | 19.48,23.91 18.93,24.54 | v18.64,24.28 18.93,24.54 | 19.51,24.57 19.02,24.11 | 19.02,24.11 18.91,24 | 18.91,24 | 18.91,24 18.9,24 | 18.9,24 | v18.64,24.28 18.9,24 | 19.51,24.57 18.68,24.66 | v18.64,24.28 18.68,24.66 | 19.54,24.08 18.72,23.91 | 18.72,23.91 | 18.72,23.91 | v18.64,24.28 18.72,23.91 | 19.54,24.08 18.88,24.59 | v18.64,24.28 18.88,24.59 | 19.54,24.48 19.02,24.09 | 19.02,24.09 18.88,23.98 | 18.88,23.98 18.87,23.98 | v18.64,24.28 18.87,23.98 | 19.51,23.99 18.91,24.56 | v18.64,24.28 18.91,24.56 | 19.48,24.64 19.01,24.12 | 19.01,24.12 18.93,24.03 | 18.93,24.03 | v18.64,24.28 18.93,24.03 | 19.48,24.64 18.65,24.66 | 18.65,24.66 | v18.64,24.28 18.65,24.66 | 19.54,24.12 19.05,23.99 | 19.05,23.99 18.74,23.91 | 18.74,23.91 | 18.74,23.91 | v18.64,24.28 18.74,23.91 | 19.54,24.12 18.86,24.59 | 18.86,24.59 | v18.64,24.28 18.86,24.59 | 19.54,24.45 18.86,23.97 | 18.86,23.97 | 18.86,23.97 | 18.86,23.97 | 18.86,23.97 | 19.54,24.45 18.73,24.65 | 18.73,24.65 | v18.64,24.28 18.73,24.65 | 19.49,23.94 19.07,23.92 | 19.07,23.92 18.66,23.9 | v18.64,24.28 18.66,23.9 | 19.49,23.94 19.01,24.45 | 19.01,24.45 18.92,24.54 | 18.92,24.54 | 19.51,24.58 19.02,24.11 | 19.02,24.11 18.91,24.01 | v18.64,24.28 18.91,24.01 | 19.51,24.58 18.68,24.66 | 18.68,24.66 | v18.64,24.28 18.68,24.66 | 19.54,24.09 19.05,23.98 | 19.05,23.98 18.73,23.91 | 18.73,23.91 | 19.54,24.09 18.87,24.59 | v18.64,24.28 18.87,24.59 | 19.54,24.48 19.02,24.09 | 19.02,24.09 18.87,23.98 | v18.64,24.28 18.87,23.98 | 19.54,24.48 19.05,24.58 | 18.9,24.56 | 18.9,24.56 | 19.48,24.66 19.01,24.13 | 19.01,24.13 18.93,24.03 | 18.93,24.03 | v18.64,24.28 18.93,24.03 | 19.48,24.66 19.08,24.66 | 19.08,24.66 18.64,24.66
  Bottom 0.254: v18.64,24.28 18.64,24.66 | 19.55,24.13 | 19.55,24.13 19.05,24 | 19.05,24 18.74,23.91 | 18.74,23.91 | 18.74,23.91 | v18.64,24.28 18.74,23.91 | 19.55,24.13 | 19.55,24.13 19.02,24.48 | 19.02,24.48 18.86,24.6 | 19.02,24.08 18.86,23.97 | v18.64,24.28 18.86,23.97 | 19.48,24.66 19.01,24.13 | 19.01,24.13 18.93,24.03 | v18.64,24.28 18.93,24.03 | 19.54,24.46 19.02,24.08 | 19.02,24.08 18.86,23.97 | 18.86,23.97 | v18.64,24.28 18.86,23.97 | 19.54,24.46 19.05,24.58 | 19.05,24.58 18.73,24.65 | 18.73,24.65 | v18.64,24.28 18.73,24.65 | 18.66,23.9 | 18.73,23.91 | 19.05,23.99 18.74,23.91 | 18.74,23.91 | 18.88,23.98 | 19.51,23.99 19.02,24.46 | 18.9,24.56 | 18.9,24.56 | 18.74,23.91 | 19.02,24.48 18.86,24.6 | 19.54,24.13 19.05,23.99 | 18.74,23.91 | v18.64,24.28 18.74,23.91 | 19.54,24.13 18.86,24.6 | 19.02,24.11 18.91,24.01 | 18.91,24.01 | 19.54,24.48 19.02,24.09 | 19.02,24.09 18.87,23.98 | 19.54,24.48 19.05,24.58 | 19.05,24.58 18.73,24.65 | 18.73,24.66 | v18.64,24.28 18.73,24.66 | 19.51,23.98 19.07,23.94 | 19.07,23.94 18.68,23.9 | 18.68,23.9 | v18.64,24.28 18.68,23.9 | 19.51,23.98 19.02,24.45 | 19.02,24.45 18.91,24.56 | 18.91,24.56 | v18.64,24.28 18.91,24.56 | 19.49,24.63 19.01,24.12 | 19.01,24.12 18.92,24.02 | 18.92,24.02 | v18.64,24.28 18.92,24.02 | 18.66,24.66 | v18.64,24.28 18.66,24.66 | 18.73,23.91 | v18.64,24.28 18.73,23.91 | 19.54,24.11 19.02,24.48 | 19.02,24.48 18.86,24.59 | 18.86,24.59 | v18.64,24.28 18.86,24.59 | 19.54,24.45 19.02,24.08 | 19.02,24.08 18.86,23.97 | v18.64,24.28 18.86,23.97 | 18.74,24.65 | v18.64,24.28 18.74,24.65 | 19.54,24.45 19.02,24.08 | 19.02,24.08 18.86,23.97 | 19.54,24.45 19.05,24.57 | 19.05,24.57 18.74,24.65 | 18.65,23.9 | v18.64,24.28 18.65,23.9 | 19.48,23.92 19.01,24.44 | 19.01,24.44 18.93,24.54
  Bottom 0.254: v18.64,24.28 18.93,24.54 | 19.51,24.58 19.02,24.11 | 19.02,24.11 18.91,24 | v18.64,24.28 18.91,24 | 18.68,24.66 | v18.64,24.28 18.68,24.66 | 19.54,24.08 19.05,23.98 | 19.05,23.98 18.72,23.91 | 18.72,23.91 | v18.64,24.28 18.72,23.91 | 19.54,24.08 19.02,24.48 | 19.02,24.48 18.88,24.59 | 18.88,24.59 18.87,24.59 | v18.64,24.28 18.87,24.59 | 19.54,24.48 18.88,23.98 | 18.88,23.98 | v18.64,24.28 18.88,23.98 | 19.54,24.48 19.05,24.59 | 19.05,24.59 18.72,24.66 | 18.72,24.66 | 18.72,24.66 | v18.64,24.28 18.72,24.66 | 19.51,23.99 19.06,23.95 | 19.06,23.95 18.68,23.9 | 19.51,23.99 19.02,24.46 | 18.9,24.56 | v18.64,24.28 18.9,24.56 | 19.51,23.99 19.02,24.46 | 19.02,24.46 18.9,24.56 | 18.9,24.56 | v18.64,24.28 18.9,24.56 | 19.55,24.13 19.05,23.99 | 18.74,23.91 | 19.55,24.13 19.02,24.48 | 19.55,24.13 19.05,23.99 | 19.05,23.99 18.74,23.91 | 18.74,23.91 | v18.64,24.28 18.74,23.91 | 19.55,24.13 19.02,24.48 | 19.02,24.48 18.86,24.6 | 18.86,24.6 | v18.64,24.28 18.86,24.6 | 19.54,24.46 19.02,24.08 | 19.02,24.08 18.86,23.97 | 18.86,23.97 | 19.54,24.46 19.05,24.58 | 19.05,24.58 18.73,24.65 | 18.73,24.65 | v18.64,24.28 18.73,24.65 | 19.49,23.95 19.07,23.92 | 19.07,23.92 18.66,23.9 | 18.66,23.9 | v18.64,24.28 18.66,23.9 | 19.49,23.95 19.01,24.45 | 19.01,24.45 18.92,24.55 | 18.92,24.55 | v18.64,24.28 18.92,24.55 | 19.51,24.59 19.02,24.11 | 19.02,24.11 18.91,24.01 | v18.64,24.28 18.91,24.01 | 19.51,24.59 19.07,24.63 | 19.07,24.63 18.68,24.66 | 18.68,24.66 | v18.64,24.28 18.68,24.66 | 19.54,24.09 19.05,23.98 | 19.05,23.98 18.73,23.91 | 18.73,23.91 | 18.73,23.91 | 19.54,24.09 19.02,24.48 | 19.02,24.48 18.87,24.59 | 18.87,24.59 | 18.87,24.59 | v18.64,24.28 18.87,24.59 | 19.54,24.48 19.02,24.09 | 19.02,24.09 18.88,23.98 | 18.88,23.98
  Bottom 0.254: 18.65,24.66 | 19.48,24.65 19.01,24.12 | 19.48,24.65 19.08,24.66 | 19.08,24.66 18.65,24.66 | v18.64,24.28 18.65,24.66 | 19.05,23.99 18.74,23.91 | 18.74,23.91 | 18.74,23.91 | 18.74,23.91 | 19.05,23.99 18.74,23.91 | 19.54,24.48 19.02,24.09 | 19.02,24.09 18.88,23.98 | 18.88,23.98 | v18.64,24.28 18.88,23.98 | 19.54,24.48 19.05,24.59 | 19.05,24.59 18.72,24.66 | 18.72,24.66 | v18.64,24.28 18.72,24.66 | 19.51,23.99 19.06,23.95 | 18.68,23.9 | 19.51,23.99 19.02,24.46 | 18.9,24.56 | 19.51,23.99 19.06,23.95 | 19.06,23.95 18.68,23.9 | 18.68,23.9 | v18.64,24.28 18.68,23.9 | 19.51,23.99 19.02,24.46 | 19.02,24.46 18.9,24.56 | 18.9,24.56 | v18.64,24.28 18.9,24.56 | 19.48,24.66 19.01,24.13 | 19.01,24.13 | 19.01,24.13 18.93,24.03 | 19.48,24.66 18.64,24.66 | v18.64,24.28 18.64,24.66 | 18.74,23.91 | 18.74,23.91 | 19.54,24.13 19.02,24.48 | 19.54,24.13 19.05,23.99 | 19.05,23.99 18.74,23.91 | 19.54,24.13 19.02,24.48 | 19.02,24.48 18.86,24.6 | 18.86,24.6 | v18.64,24.28 18.86,24.6 | 19.49,23.95 19.07,23.92 | 19.07,23.92 18.66,23.9 | 18.66,23.9 | v18.64,24.28 18.66,23.9 | 19.49,23.95 19.01,24.45 | 19.01,24.45 18.92,24.55 | v18.64,24.28 18.92,24.55 | 19.51,24.59 19.02,24.11 | 19.02,24.11 18.91,24.01 | 18.91,24.01 | v18.64,24.28 18.91,24.01 | 19.54,24.09 19.05,23.98 | 19.05,23.98 18.73,23.91 | 18.73,23.91 | v18.64,24.28 18.73,23.91 | 19.54,24.09 19.02,24.48 | 19.02,24.48 18.87,24.59 | 18.87,24.59 | v18.64,24.28 18.87,24.59 | 19.54,24.12 19.05,23.99 | 19.54,24.12 19.02,24.48 | 19.02,24.48 18.86,24.6 | v18.64,24.28 18.86,24.6 | 19.54,24.48 19.02,24.09 | 19.02,24.09 18.88,23.98 | 18.88,23.98 | 18.88,23.98 | 19.54,24.48 19.05,24.59 | 19.05,24.59 18.72,24.66 | 18.72,24.66 | v18.64,24.28 18.72,24.66 | 19.51,23.99 19.06,23.95 | 19.06,23.95 18.68,23.9
  Bottom 0.254: 19.51,23.99 18.9,24.56 | v18.64,24.28 18.9,24.56 | 19.48,24.66 19.01,24.13 | 19.01,24.13 18.93,24.03 | v18.64,24.28 18.93,24.03 | 19.48,24.66 18.65,24.66 | v18.64,24.28 18.65,24.66 | 19.54,24.12 19.05,23.99 | 19.05,23.99 18.74,23.91 | 18.74,23.91 | v18.64,24.28 18.74,23.91 | 19.54,24.12 19.02,24.48 | 19.02,24.48 18.86,24.6 | 18.86,24.6 | 19.48,24.65 19.01,24.12 | 19.01,24.12 18.93,24.03 | v18.64,24.28 18.93,24.03 | 19.48,24.65 19.08,24.66 | 19.08,24.66 | 19.08,24.66 18.65,24.66 | 19.54,24.12 19.05,23.99 | 19.05,23.99 18.74,23.91 | 19.54,24.12 19.02,24.48 | 19.54,24.12 19.05,23.99 | 19.05,23.99 18.74,23.91 | v18.64,24.28 18.74,23.91 | 19.54,24.12 19.02,24.48 | 19.02,24.48 18.86,24.6 | v18.64,24.28 18.86,24.6 | 18.4,25.16 18.93,24.53 | v18.64,24.28 18.93,24.53 | 18.4,25.16 18.27,24.34 | v18.64,24.28 18.27,24.34 | 19.49,24.64 19.01,24.12 | 19.01,24.12 18.93,24.02 | v18.64,24.28 18.93,24.02 | 19.49,24.64 19.08,24.65 | 19.08,24.65 18.66,24.66 | v18.64,24.28 18.66,24.66 | 17.77,24 18.39,24.56 | v18.64,24.28 18.39,24.56 | 18.6,23.9 | v18.64,24.28 18.6,23.9 | 17.7,43.73 17.65,42.9 | 17.65,42.9 | 17.7,43.73 17.04,43.23 | v17.27,42.93 17.04,43.23 | 16.46,42.5 16.97,43.16 | v17.27,42.93 16.97,43.16 | 17.29,42.55 | v17.27,42.93 17.29,42.55 | 11.46,42.58 | 10.39,42.93 | 10.39,42.93 | 12.22,42.93 11.46,42.58 | v11.3,42.93 11.46,42.58 | 12.22,42.93 | 12.22,42.93 11.46,43.27 | 11.46,43.27 | 12.22,42.93 11.46,43.27 | v11.3,42.93 11.46,43.27 | 10.39,42.93 11.14,43.27 | 11.14,43.27 | v11.3,42.93 11.14,43.27 | 10.39,42.93 11.14,42.58 | 11.14,43.27 | v11.3,42.93 11.14,43.27 | 11.14,42.58 | v11.3,42.93 11.14,42.58 | 12.22,42.93 11.46,42.58 | 12.22,42.93 11.46,43.27 | 12.22,42.93 11.46,42.58 | 12.22,42.93 11.46,43.27
  Bottom 0.254: 19.8,45.84 20.09,46.62 | 20.09,46.62 | v20.45,46.48 20.09,46.62 | 19.8,45.84 20.58,46.12 | 19.8,45.84 20.09,46.62 | v20.45,46.48 20.09,46.62 | 20.58,46.12 | v20.45,46.48 20.58,46.12 | 7.95,36.56 7.17,36.85 | C8.2 7.17,36.85 | 7.95,36.56 7.66,37.34 | 7.66,37.34 | 20.3,39.37 | 20.3,39.37 | 20.3,39.37 21.05,39.02 | 20.3,39.37 21.05,39.72 | 21.05,39.72 | v21.21,39.37 21.05,39.72 | 20.3,39.37 21.05,39.02 | 20.3,39.37 21.05,39.72 | 21.05,39.02 | 21.05,39.72 | 21.05,39.02 | v21.21,39.37 21.05,39.02 | 20.3,39.37 | 20.3,39.37 21.05,39.72 | v21.21,39.37 21.05,39.72 | 20.3,39.37 | 20.3,39.37 21.05,39.02 | v21.21,39.37 21.05,39.02 | 20.3,39.37 21.05,39.72 | 20.3,39.37 21.05,39.02 | v21.21,39.37 21.05,39.02 | 20.3,39.37 21.05,39.72 | v21.21,39.37 21.05,39.72 | 21.65,40.17 20.98,39.68 | v21.21,39.37 20.98,39.68 | 21.65,40.17 21.59,39.34 | v21.21,39.37 21.59,39.34 | 19.82,23.91 | 19.7,24.6 | 19.01,24.12 19.51,23.99 | 19.51,23.99 19.82,23.91 | 19.82,23.91 | v19.91,24.28 19.82,23.91 | 19.01,24.12 19.7,24.6 | 19.08,24.66 19.54,24.13 | 19.54,24.13 19.63,24.03 | 19.63,24.03 | v19.91,24.28 19.63,24.03 | 19.08,24.66 19.91,24.66 | 19.91,24.66 | v19.91,24.28 19.91,24.66 | 19.01,24.12 | 19.82,23.91 | v19.91,24.28 19.82,23.91 | 19.01,24.12 19.7,24.59 | 19.7,24.59 19.7,24.6 | v19.91,24.28 19.7,24.6 | 19.02,24.08 | 19.51,23.98 19.83,23.91 | 19.83,23.91 | 19.84,23.91 | 19.63,24.54 | 19.69,24.59 | 19.01,24.13 19.51,24 | 19.51,24 19.82,23.91 | 19.82,23.91 | 19.01,24.13 19.54,24.48 | 19.54,24.48 19.7,24.6 | 19.7,24.6 | v19.91,24.28 19.7,24.6 | 19.05,23.98 19.65,24.56 | 19.65,24.56 | 19.65,24.56 | 19.02,24.08 19.83,23.91 | 19.02,24.08 19.54,24.48 | 19.89,23.9 | 19.84,24.66 | 19.02,24.48 | 19.54,24.11 19.65,24.01 | 19.88,24.66 | 19.07,24.64 19.54,24.12
  Bottom 0.254: 19.54,24.12 19.63,24.02 | v19.91,24.28 19.63,24.02 | 19.07,24.64 19.48,24.65 | 19.48,24.65 19.9,24.66 | v19.91,24.28 19.9,24.66 | 19.08,24.65 19.63,24.03 | 19.08,24.65 19.48,24.66 | 19.91,24.66 | v19.91,24.28 19.91,24.66 | 19.02,24.48 19.54,24.09 | 19.54,24.09 19.68,23.98 | 19.02,24.48 19.84,24.66 | 19.02,24.09 19.51,23.98 | 19.02,24.09 19.68,24.59 | 19.69,24.59 | v19.91,24.28 19.69,24.59 | 19.68,24.59 | 19.02,24.08 19.54,24.48 | 19.54,24.48 19.68,24.59 | 19.68,24.59 | 19.02,24.08 19.68,24.59 | 19.68,24.59 | 19.68,24.59 | v19.91,24.28 19.68,24.59 | 19.87,24.66 | 19.05,23.98 19.65,24.56 | 19.65,24.56 | 19.51,24.59 19.83,24.66 | 19.84,24.66 | 19.65,24.56 | 19.68,23.98 | 19.84,24.66 | 19.01,24.12 19.51,23.99 | 19.51,23.99 19.82,23.91 | 19.05,23.99 19.49,23.95 | 19.05,23.99 19.54,24.46 | 19.65,24.56 | v19.91,24.28 19.65,24.56 | 19.48,23.92 19.89,23.9 | 19.02,24.09 19.51,23.98 | 19.83,23.91 | 19.83,23.91 | 19.83,23.91 | 19.83,23.91 | 19.02,24.09 19.54,24.48 | 19.54,24.11 19.65,24.01 | 19.65,24.01 | 19.64,24.54 | 19.07,23.94 19.48,23.92 | 19.9,23.9 | v19.91,24.28 19.9,23.9 | 19.07,23.94 19.54,24.45 | 19.54,24.45 19.64,24.54 | 19.54,24.12 19.63,24.03 | 19.63,24.03 | 19.07,24.64 19.9,24.66 | 19.87,23.9 | v19.91,24.28 19.87,23.9 | 19.05,23.99 19.54,24.45 | 19.54,24.45 19.65,24.56 | v19.91,24.28 19.65,24.56 | 19.54,24.09 19.68,23.98 | 19.68,23.98 | 19.68,23.98 | 19.68,23.98 | 19.02,24.48 19.83,24.66 | 19.02,24.08 19.51,23.98 | 19.02,24.08 19.54,24.48 | 19.54,24.48 19.68,24.59 | 19.68,24.59 | v19.91,24.28 19.68,24.59 | 19.02,24.08 19.51,23.98 | 19.51,23.98 19.83,23.91 | 19.83,23.91 19.84,23.91 | 19.84,23.91 | v19.91,24.28 19.84,23.91 | 19.02,24.08 19.54,24.48 | 19.54,24.48 19.68,24.59 | 19.05,24.57 19.65,24 | 19.65,24 | 19.65,24
  Bottom 0.254: 19.08,23.91 19.91,23.9 | 19.08,23.91 19.63,24.54 | v19.91,24.28 19.63,24.54 | 19.08,23.91 19.48,23.91 | 19.48,23.91 19.91,23.9 | 19.91,23.9 | v19.91,24.28 19.91,23.9 | 19.08,23.91 19.54,24.44 | 19.54,24.44 19.63,24.54 | 19.01,24.44 19.7,23.97 | 19.7,23.97 | v19.91,24.28 19.7,23.97 | 19.01,24.44 19.82,24.65 | 19.02,24.11 19.82,23.91 | 19.02,24.11 19.54,24.48 | 19.02,24.11 19.51,23.99 | 19.51,23.99 19.82,23.91 | 19.82,23.91 | 19.82,23.91 | 19.82,23.91 | v19.91,24.28 19.82,23.91 | 19.02,24.11 19.54,24.48 | 19.54,24.48 19.69,24.59 | 19.69,24.59 | v19.91,24.28 19.69,24.59 | 19.48,24.64 19.89,24.66 | 19.05,23.98 19.65,24.56 | v19.91,24.28 19.65,24.56 | 19.51,23.98 19.83,23.91 | 19.02,24.09 19.68,24.59 | 19.69,24.59 | v19.91,24.28 19.69,24.59 | 19.49,24.63 19.88,24.66 | 19.88,24.66 | 19.06,23.95 19.48,23.92 | 19.48,23.92 19.89,23.9 | 19.89,23.9 | 19.89,23.9 | 19.64,24.55 | v19.91,24.28 19.64,24.55 | 19.54,24.08 19.69,23.97 | 19.02,24.46 19.82,24.65 | 19.82,24.65 | 19.08,24.66 19.62,24.03 | v19.91,24.28 19.62,24.03 | 19.05,23.99 19.87,23.9 | 19.05,23.99 19.65,24.56 | 19.65,24.56 | 19.02,24.48 19.54,24.09 | 19.54,24.09 19.68,23.98 | 19.02,24.48 19.84,24.66 | 19.84,24.66 | v19.91,24.28 19.84,24.66 | 19.02,24.08 19.68,24.59 | 19.05,24.58 19.65,24 | v19.91,24.28 19.65,24 | 19.49,24.62 19.87,24.66 | 19.48,23.91 19.9,23.9 | 19.63,24.54 | v19.91,24.28 19.63,24.54 | 19.01,24.45 19.54,24.08 | 19.54,24.08 19.7,23.97 | 19.7,23.97 | 19.7,23.97 | v19.91,24.28 19.7,23.97 | 19.01,24.45 19.82,24.65 | 19.82,24.65 | v19.91,24.28 19.82,24.65 | 19.02,24.11 19.82,23.91 | 19.02,24.11 19.69,24.59 | 19.02,24.11 19.51,23.99 | 19.51,23.99 19.82,23.91 | v19.91,24.28 19.82,23.91 | 19.02,24.11 19.54,24.48 | 19.54,24.48 19.69,24.59
  Bottom 0.254: 19.02,24.48 19.83,24.65 | 19.01,24.13 19.51,23.99 | 19.01,24.13 19.54,24.48 | 19.02,24.08 19.51,23.98 | 19.51,23.98 19.83,23.91 | 19.83,23.91 | 19.83,23.91 | 19.02,24.08 19.68,24.59 | 19.68,24.59 | v19.91,24.28 19.68,24.59 | 19.02,24.08 19.51,23.98 | 19.51,23.98 19.83,23.91 | 19.83,23.91 | v19.91,24.28 19.83,23.91 | 19.02,24.08 19.68,24.59 | 19.05,24.58 19.54,24.11 | 19.65,24 | v19.91,24.28 19.65,24 | 19.54,24.11 19.65,24.01 | 19.65,24.01 | 19.49,24.63 19.88,24.66 | 19.54,24.08 19.69,23.97 | 19.02,24.46 19.51,24.58 | 19.51,24.58 19.82,24.65 | 19.82,24.65 | 19.01,24.13 19.51,23.99 | 19.82,23.91 | v19.91,24.28 19.82,23.91 | 19.01,24.13 19.54,24.48 | 19.7,24.6 | v19.91,24.28 19.7,24.6 | 19.54,24.09 19.68,23.98 | 19.02,24.48 19.84,24.66 | 19.54,24.46 19.65,24.56 | 19.65,24.56 | v19.91,24.28 19.65,24.56 | 19.07,23.92 19.9,23.9 | 19.9,23.9 | 19.05,23.98 19.49,23.94 | 19.49,23.94 19.88,23.9 | 19.05,23.98 19.65,24.56 | 19.65,24.56 | 19.54,24.09 19.68,23.98 | 19.51,24.58 19.83,24.65 | 19.05,23.99 19.65,24.56 | 19.02,24.48 19.54,24.09 | 19.54,24.09 19.68,23.98 | 19.02,24.48 19.51,24.59 | 19.84,24.66 | v19.91,24.28 19.84,24.66 | 19.02,24.48 19.51,24.59 | 19.84,24.66 | 19.02,24.09 19.51,23.98 | 19.83,23.91 | v19.91,24.28 19.83,23.91 | 19.02,24.09 19.54,24.48 | 19.05,24.59 19.54,24.11 | 19.05,24.59 | 19.54,24.08 19.69,23.97 | 19.69,23.97 | v19.91,24.28 19.69,23.97 | 19.51,24.58 19.82,24.65 | 19.82,24.65 | v19.91,24.28 19.82,24.65 | 19.08,24.66 19.55,24.13 | 19.55,24.13 19.62,24.03 | 19.62,24.03 | 19.62,24.03 19.63,24.03 | 19.63,24.03 | v19.91,24.28 19.63,24.03 | 19.05,23.99 19.65,24.56 | 19.49,23.95 19.87,23.9 | 19.05,23.99 19.65,24.56 | 19.65,24.56 | v19.91,24.28 19.65,24.56 | v19.91,24.28 19.68,23.98 | 19.84,24.66
  Bottom 0.254: v19.91,24.28 19.84,24.66 | 19.51,23.99 19.82,23.91 | 19.82,23.91 | 19.02,24.48 19.51,24.59 | 19.51,24.59 19.83,24.66 | 19.83,24.66 19.84,24.66 | v19.91,24.28 19.84,24.66 | 19.01,24.12 19.82,23.91 | 19.82,23.91 | 19.82,23.91 | 19.01,24.12 19.7,24.59 | 19.7,24.59 19.7,24.6 | 19.02,24.09 19.83,23.91 | 19.02,24.09 19.54,24.48 | 19.68,24.59 19.69,24.59 | v19.91,24.28 19.69,24.59 | 19.05,24.59 19.54,24.11 | 19.54,24.11 19.65,24.01 | 19.65,24.01 | 19.65,24.01 | v19.91,24.28 19.65,24.01 | 19.05,24.59 19.49,24.63 | 19.88,24.66 | v19.91,24.28 19.88,24.66 | 19.51,23.99 19.82,23.91 | 19.82,23.91 | v19.91,24.28 19.82,23.91 | 19.49,23.95 19.87,23.9 | 19.05,23.99 19.54,24.46 | 19.54,24.46 19.65,24.56 | 19.65,24.56 | 19.51,23.98 19.83,23.91 | 19.02,24.09 19.54,24.48 | 19.54,24.48 19.68,24.59 | 19.05,24.59 19.65,24.01 | 19.65,24.01 | 19.65,24.01 | 19.05,24.59 19.49,24.63 | 19.49,24.63 19.88,24.66 | 19.88,24.66 | 19.54,24.09 19.68,23.98 | 19.68,23.98 | 19.51,24.59 19.84,24.66 | 19.02,24.48 19.68,23.98 | 19.51,24.59 19.84,24.66 | 19.02,24.48 19.68,23.98 | 19.68,23.98 | v19.91,24.28 19.68,23.98 | 19.51,24.59 19.84,24.66 | 19.05,23.99 19.87,23.9 | 19.02,24.11 19.69,24.59 | 19.07,24.63 19.64,24.02 | 19.64,24.02 | 19.9,24.66 | 19.05,23.98 19.88,23.9 | 19.88,23.9 | 19.05,23.98 19.65,24.56 | 19.02,24.48 19.68,23.98 | 19.02,24.48 19.51,24.58 | 19.51,24.58 19.83,24.65 | 19.02,24.48 19.68,23.98 | 19.68,23.98 | 19.02,24.48 19.83,24.65 | 19.02,24.11 19.51,23.99 | 19.51,23.99 19.82,23.91 | 19.82,23.91 | 19.02,24.11 19.54,24.48 | 19.54,24.48 19.69,24.59 | 19.69,24.59 | 19.07,24.63 19.64,24.02 | v19.91,24.28 19.64,24.02 | 19.07,24.63 | 19.07,24.63 19.9,24.66 | 19.9,24.66 | v19.91,24.28 19.9,24.66 | 19.54,24.45 19.64,24.55 | 19.51,23.98 19.83,23.91
  Bottom 0.254: 19.83,23.91 | 19.83,23.91 | 19.54,24.48 19.68,24.59 | 19.48,23.92 19.9,23.9 | 19.9,23.9 | 19.07,23.94 19.64,24.54 | 19.64,24.54 | v19.91,24.28 19.64,24.54 | 19.54,24.08 19.69,23.97 | 19.02,24.45 19.82,24.65 | 19.01,24.12 19.82,23.91 | 19.82,23.91 | 19.82,23.91 | 19.01,24.12 | 19.01,24.12 19.7,24.59 | v19.91,24.28 19.7,24.59 | 19.49,23.94 19.87,23.9 | 19.87,23.9 | 19.05,23.99 19.65,24.56 | 19.65,24.56 | 19.54,24.45 19.64,24.55 | 19.54,24.09 19.68,23.98 | 19.68,23.98 | 19.51,24.58 19.83,24.65 | 19.02,24.09 19.51,23.98 | 19.51,23.98 19.83,23.91 | 19.83,23.91 | 19.02,24.09 19.68,24.59 | 19.68,24.59 19.69,24.59 | 19.48,23.92 19.89,23.9 | 19.89,23.9 | 19.06,23.95 19.64,24.55 | 19.64,24.55 | 19.51,23.99 19.82,23.91 | 19.49,23.95 19.87,23.9 | 19.87,23.9 | 19.83,23.91 | 19.02,24.08 19.68,24.59 | 19.68,24.59 | 19.05,24.58 19.54,24.11 | 19.54,24.11 19.65,24 | v19.91,24.28 19.65,24 | 19.05,24.58 19.49,24.62 | 19.05,23.98 19.88,23.9 | 19.05,23.98 19.54,24.45 | 19.54,24.45 19.65,24.56 | 19.65,24.56 | 19.65,24.56 | v19.91,24.28 19.65,24.56 | 19.02,24.08 19.68,24.59 | 19.68,24.59 | 19.02,24.11 19.82,23.91 | 19.82,23.91 | v19.91,24.28 19.82,23.91 | 19.02,24.11 19.69,24.59 | 19.07,24.63 19.54,24.12 | 19.54,24.12 19.64,24.02 | 19.64,24.02 | 19.07,24.63 19.48,24.64 | 19.48,24.64 19.9,24.66 | 19.05,23.98 19.49,23.94 | 19.49,23.94 19.88,23.9 | 19.05,23.98 19.65,24.56 | 19.65,24.56 | 19.02,24.48 19.54,24.09 | 19.54,24.09 19.68,23.98 | v19.91,24.28 19.68,23.98 | 19.02,24.48 19.83,24.65 | 19.83,24.65 19.83,24.66 | 19.83,24.66 | 19.02,24.09 19.83,23.91 | 19.83,23.91 | v19.91,24.28 19.83,23.91 | 19.02,24.09 19.68,24.59 | 19.05,24.58 19.54,24.11 | 19.65,24.01 | v19.91,24.28 19.65,24.01 | 19.05,24.58 19.88,24.66 | 19.88,24.66 | v19.91,24.28 19.88,24.66
  Bottom 0.254: 19.07,23.94 19.9,23.9 | v19.91,24.28 19.9,23.9 | 19.07,23.94 19.64,24.54 | 19.64,24.54 | v19.91,24.28 19.64,24.54 | 19.02,24.45 19.69,23.97 | 19.69,23.97 | 19.69,23.97 | v19.91,24.28 19.69,23.97 | 19.02,24.45 19.82,24.65 | 19.82,24.65 | 19.82,24.65 | v19.91,24.28 19.82,24.65 | 19.01,24.12 19.82,23.91 | v19.91,24.28 19.82,23.91 | 19.01,24.12 19.7,24.59 | 19.7,24.59 | 19.7,24.59 | v19.91,24.28 19.7,24.59 | 19.07,24.64 19.63,24.03 | v19.91,24.28 19.63,24.03 | 19.07,24.64 19.9,24.66 | 19.9,24.66 19.91,24.66 | 19.91,24.66 | v19.91,24.28 19.91,24.66 | 19.05,23.99 19.87,23.9 | v19.91,24.28 19.87,23.9 | 19.05,23.99 19.65,24.56 | v19.91,24.28 19.65,24.56 | 19.02,24.48 19.68,23.98 | 19.68,23.98 | 19.68,23.98 | v19.91,24.28 19.68,23.98 | 19.02,24.48 19.83,24.66 | 19.83,24.66 | 19.83,24.66 | v19.91,24.28 19.83,24.66 | 19.02,24.08 19.83,23.91 | 19.83,23.91 | 19.83,23.91 19.84,23.91 | v19.91,24.28 19.84,23.91 | 19.02,24.08 19.68,24.59 | 19.68,24.59 | 19.68,24.59 | v19.91,24.28 19.68,24.59 | 19.05,24.57 19.65,24 | 19.65,24 | v19.91,24.28 19.65,24 | 19.05,24.57 19.87,24.66 | 19.87,24.66 | 19.87,24.66 | v19.91,24.28 19.87,24.66 | 19.08,23.91 19.91,23.9 | v19.91,24.28 19.91,23.9 | 19.08,23.91 19.63,24.54 | 19.63,24.54 | v19.91,24.28 19.63,24.54 | 19.01,24.44 19.7,23.97 | v19.91,24.28 19.7,23.97 | 19.01,24.44 19.82,24.65 | 19.82,24.65 | 19.82,24.65 | v19.91,24.28 19.82,24.65 | 19.02,24.11 19.82,23.91 | 19.82,23.91 | 19.82,23.91 | 19.82,23.91 | v19.91,24.28 19.82,23.91 | 19.02,24.11 19.69,24.59 | 19.69,24.59 | 19.69,24.59 | v19.91,24.28 19.69,24.59 | 19.07,24.62 19.64,24.02 | 19.64,24.02 | v19.91,24.28 19.64,24.02 | 19.07,24.62 19.89,24.66 | 19.89,24.66 | 19.89,24.66 | v19.91,24.28 19.89,24.66 | 19.05,23.98 19.88,23.9 | 19.88,23.9 | 19.88,23.9